# EasyEDA Pro project ProPrj_智能视觉集成板-V1.0.epro, board PCB1
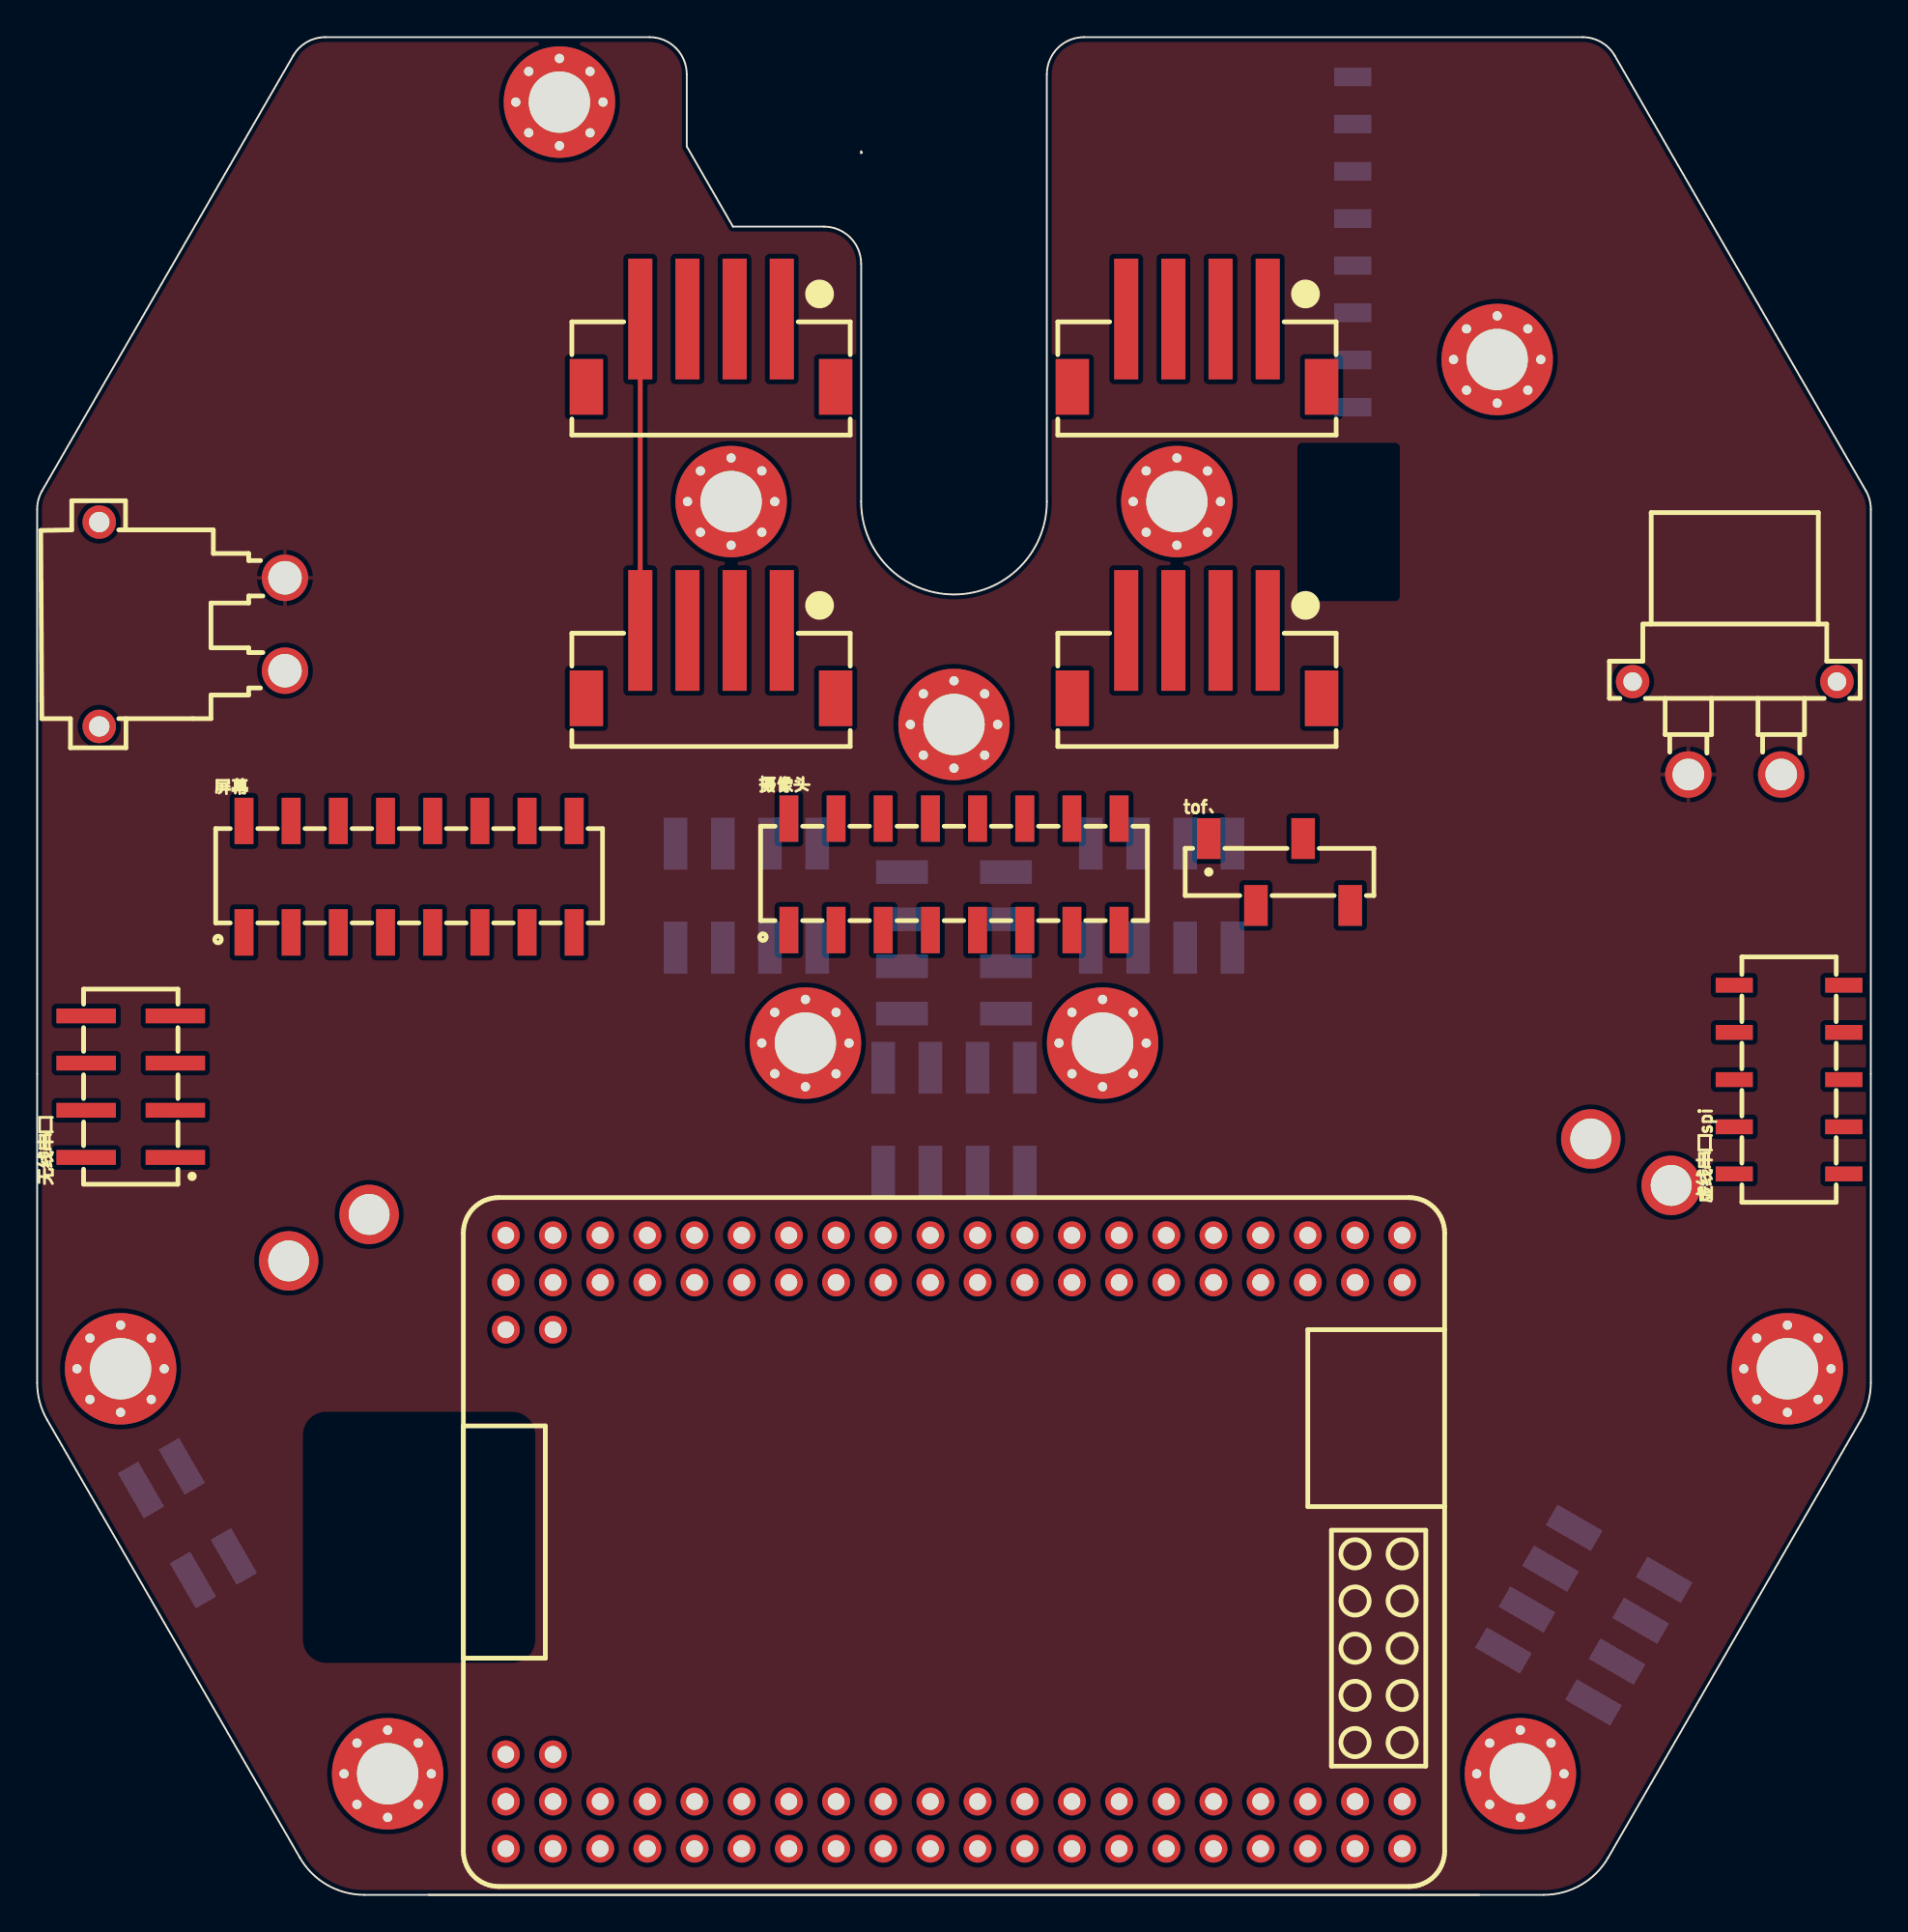
[diagram p8: board, top side]
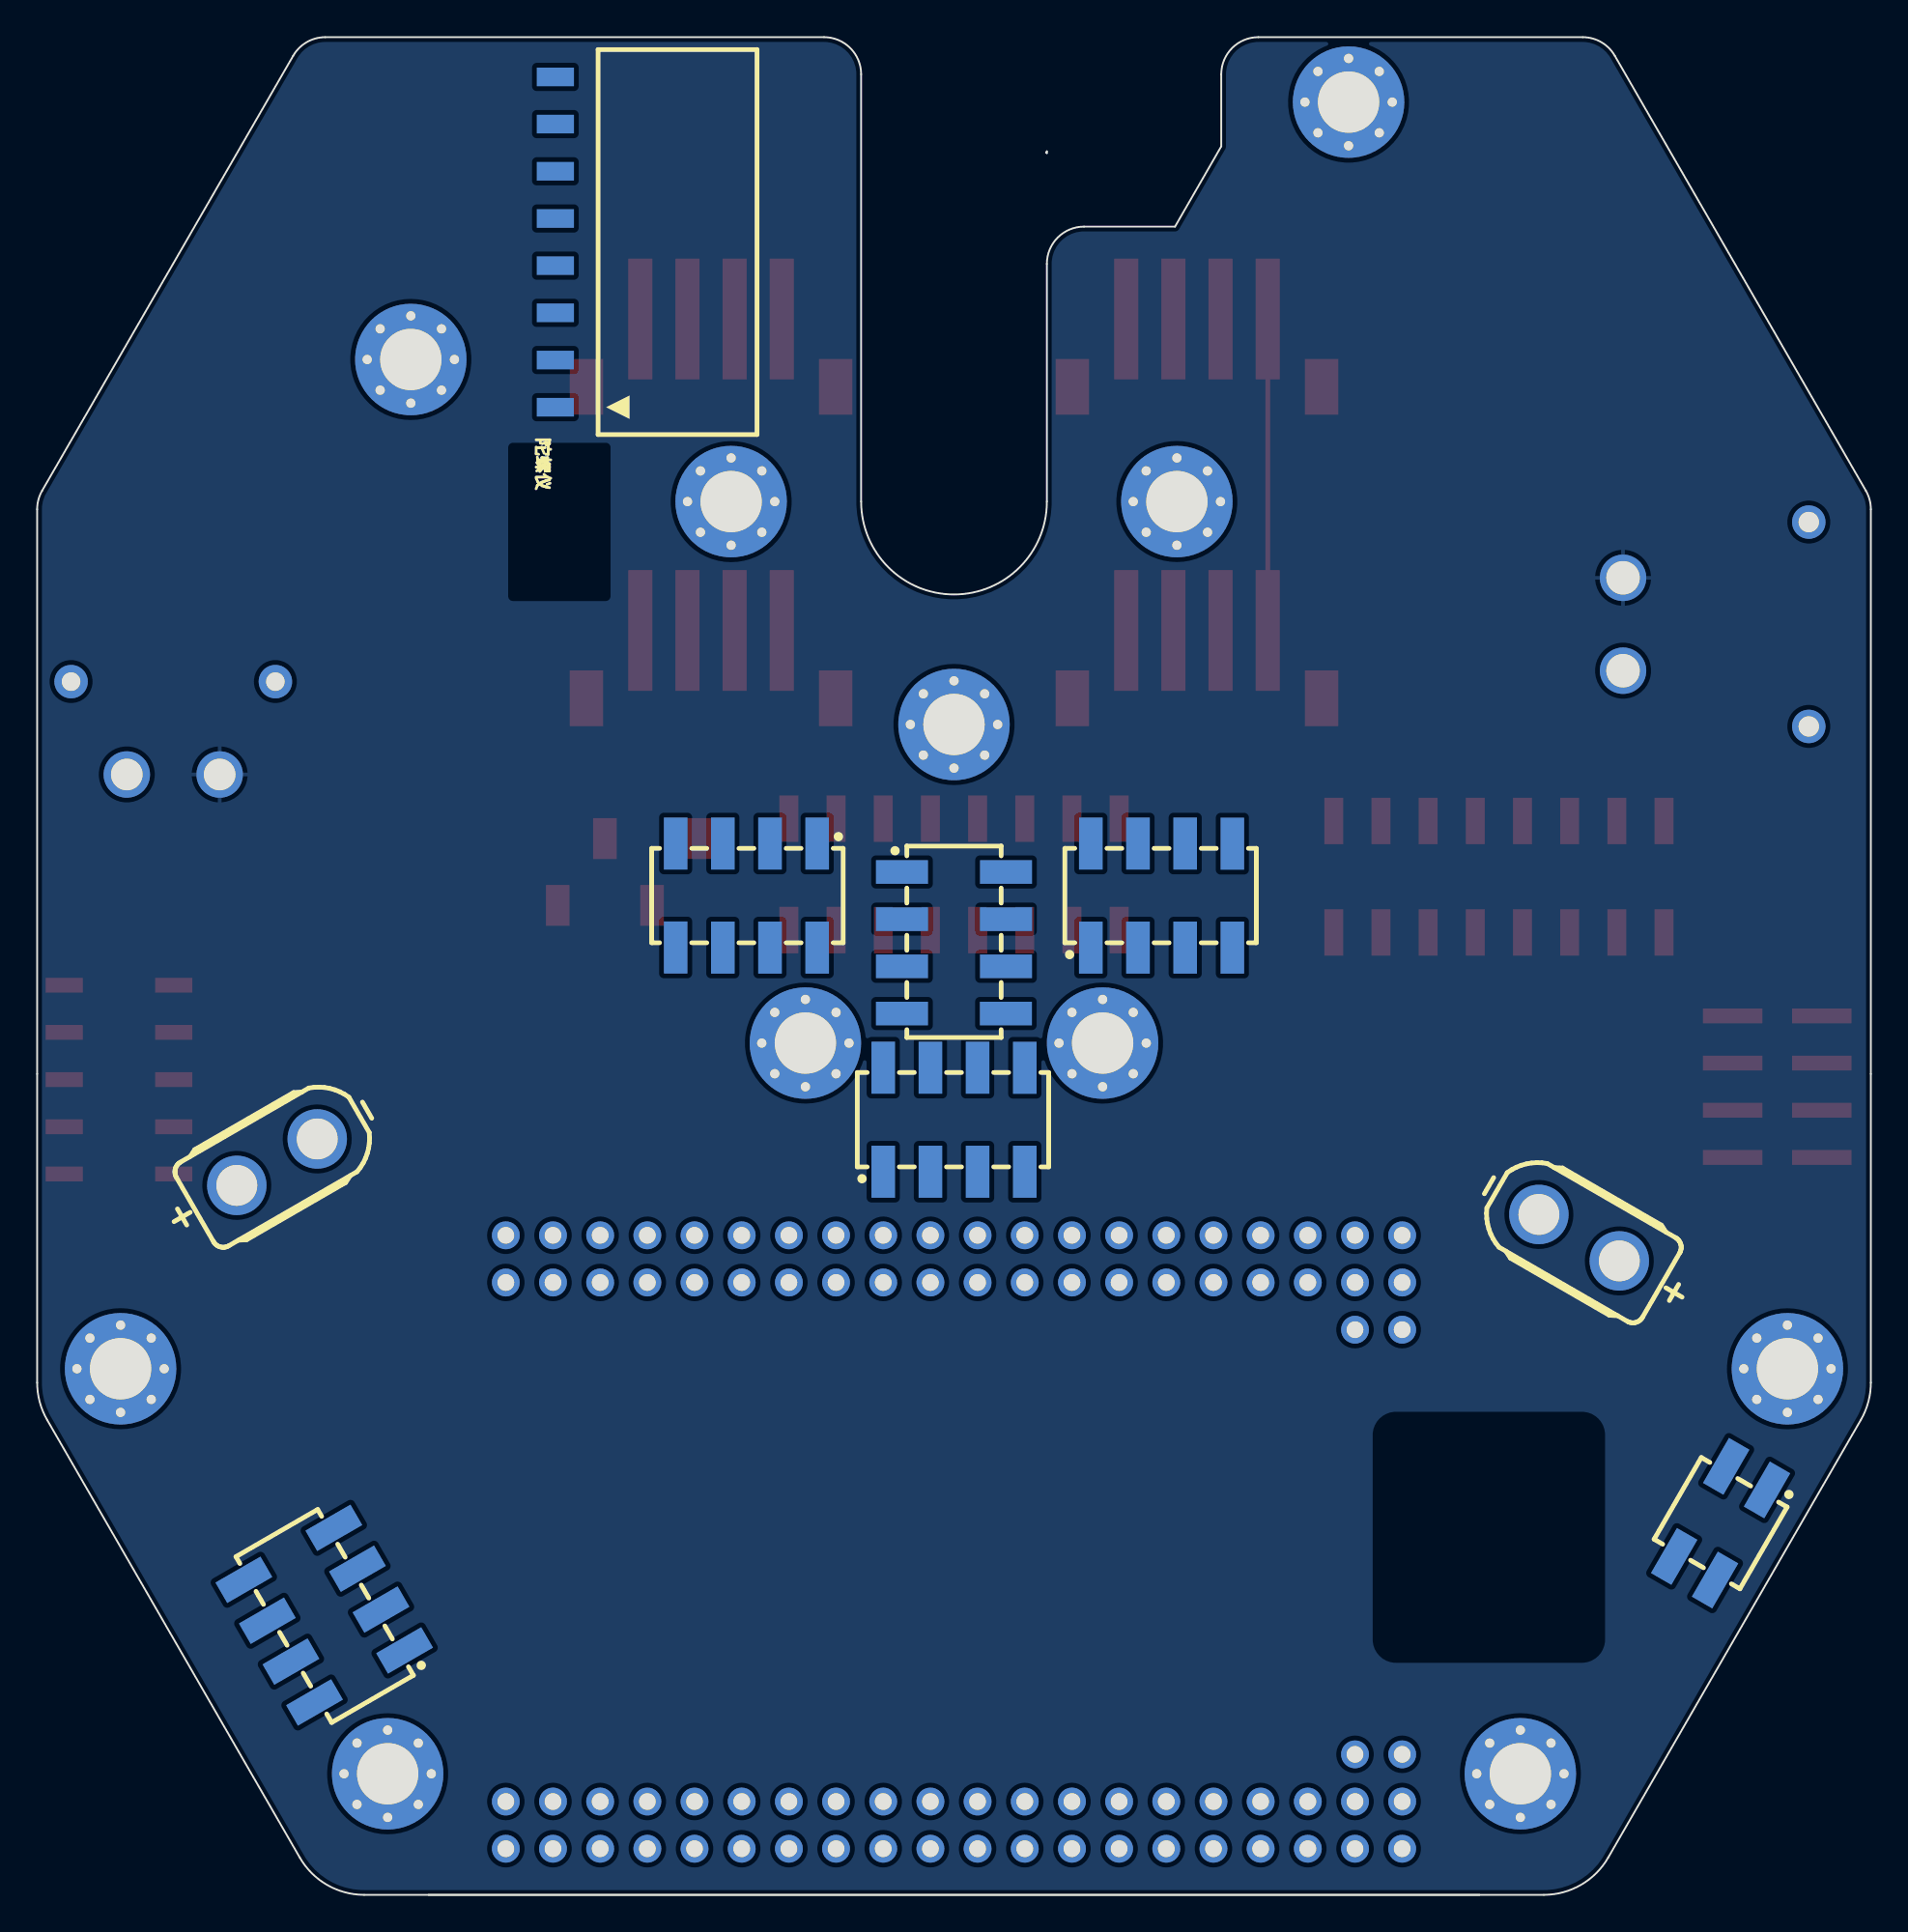
[diagram p9: board, bottom side, seen from below]

Outline 98.73 x 100 mm; copper layers: Top Layer, Bottom Layer. Coordinates in mm from the lower left corner of the outline.
Outline path: 21.07,0 77.65,0 ; 0,74.59 arc(0.07,75.1) 0.27,75.59 13.79,99 arc(14.52,99.73) 15.52,100 32.98,100 arc(34.39,99.41) 34.98,98 34.98,94.12 37.46,89.8 42.36,89.8 arc(43.78,89.21) 44.36,87.8 44.36,75 arc(49.36,70) 54.36,75 54.36,98 arc(54.95,99.41) 56.36,100 83.21,100 arc(84.21,99.73) 84.94,99 98.46,75.59 arc(98.66,75.1) 98.73,74.59 98.73,27.57 arc(98.59,26.54) 98.19,25.57 84.58,2 arc(83.12,0.54) 81.12,0 17.61,0 arc(15.61,0.54) 14.14,2 0.54,25.57 arc(0.14,26.54) 0,27.57 0,74.59 ; 44.36,93.76 44.36,93.85 44.4,93.78 44.36,93.76
Stack: Top Layer 0.035mm / Dielectric1 1.51mm FR4 er 4.5 / Bottom Layer 0.035mm

## Design rules (mm)
template: JLCPCB Capability(Two Layers Board)
spacing copperThickness1oz (default): track to track 0.102, other pairs 0.152 to 0.3
spacing copperThickness2oz: track to track 0.203, other pairs 0.152 to 0.3
track width copperThickness1oz (default): min 0.127, default 0.254, max 2.54
track width copperThickness2oz: min 0.203, default 0.254, max 2.54
differential pair differentialPair (default): width min 0.127, default 0.254, max 2.54; gap min 0.152, default 0.152
via viaSize (default): diameter min 0.5, default 0.61, max 10; hole min 0.3, default 0.305, max 6.3

## Placement (name value [footprint] x y rotation side)
CN6  XT30PW-M30.G.Y  [CONN-TH_XT30PW-M]  8.34 68.4 270 top
CN8  XT30UPB-F30.G.Y  [CONN-TH_XT30UPB-F]  85.81 39.44 150 bottom
CN9  XT30UPB-F30.G.Y  [CONN-TH_XT30UPB-F]  15.71 35.38 30 bottom
H1  2.54-2*4P立贴针  [HDR-SMD_8P-P2.54-V-M-R2-C4-LS7.4]  49.36 41.73 180 bottom
H2  2.54-2*4P立贴针  [HDR-SMD_8P-P2.54-V-M-R2-C4-LS7.4]  49.36 51.25 270 bottom
H3  2.54-2*4P立贴针  [HDR-SMD_8P-P2.54-V-M-R2-C4-LS7.4]  83.27 15.06 60 bottom
H4  2.54-2*4P立贴针  [HDR-SMD_8P-P2.54-V-M-R2-C4-LS7.4]  60.54 53.79 0 bottom
H5  2.54-2*4P立贴针  [HDR-SMD_8P-P2.54-V-M-R2-C4-LS7.4]  38.19 53.79 180 bottom
H6  X6521WVS-2x02H-C60D74  [HDR-SMD_4P-P2.54-V-M-R2-C5-S7.4]  8.09 20.01 30 bottom
J1  -  [M3螺帽]  18.87 6.52 0 top
J2  -  [M3螺帽]  57.36 45.85 0 top
J3  -  [M3螺帽]  41.36 45.85 0 top
J4  -  [M3螺帽]  79.86 6.52 0 top
J5  -  [M3螺帽]  94.24 28.32 0 top
J6  -  [M3螺帽]  4.49 28.32 0 top
J7  -  [M3螺帽]  37.36 75 0 top
J8  -  [M3螺帽]  28.12 96.5 0 top
J9  -  [M3螺帽]  49.36 63 0 top
J10  -  [M3螺帽]  61.36 75 0 top
J11  -  [M3螺帽]  78.61 82.65 0 top
tof、  X6511WVS-04H-C60D48R1  [HDR-SMD_4P-P2.54-V-M-S4.8]  66.89 55.06 0 top
U56  XT30PW-F20.G.Y  [CONN-TH_XT30PW-F-1]  91.4 62.81 180 top
U59  HX 2.54-4PIN LTJS  [CONN-SMD_4P-P2.54_HX-2.54-4PIN-LTJS]  62.44 83 0 top
U60  HX 2.54-4PIN LTJS  [CONN-SMD_4P-P2.54_HX-2.54-4PIN-LTJS]  62.44 66.24 0 top
U61  -  [MIMXRT1064xVL_CoreBoard - 3D]  49.36 18.99 180 top
U62  HX 2.54-4PIN LTJS  [CONN-SMD_4P-P2.54_HX-2.54-4PIN-LTJS]  36.28 83 0 top
U63  HX 2.54-4PIN LTJS  [CONN-SMD_4P-P2.54_HX-2.54-4PIN-LTJS]  36.28 66.24 0 top
屏幕  PM254-2-08-S-8.5  [HDR-SMD_16P-P2.54-V-F-R2-C8-LS7.1]  20.03 54.81 0 top
摄像头  PM254-2-08-S-8.5  [HDR-SMD_16P-P2.54-V-F-R2-C8-LS7.1]  49.36 54.93 0 top
无线串口  PM254-2-04-S-8.5  [HDR-SMD_8P-P2.54-V-F-R2-C4-S7.1]  5.04 43.5 90 top
虚线串口spi  PM254-2-05-S-8.5  [HDR-SMD_10P-P2.54-V-F-R2-C5-LS7.1-1]  94.32 43.89 90 top
陀螺仪  X6511FRS-08-C85D30  [HDR-SMD_8P-P2.54-H-F-L11.5]  70.83 88.97 90 bottom

## Footprints (pads in the part's own frame, mm; a bottom-side part is the same pattern mirrored in y, then rotated)
CONN-SMD_4P-P2.54_HX-2.54-4PIN-LTJS
  rect 1.3x6.5 smd: 1(3.81,1.825) 2(1.27,1.825) 3(-1.27,1.825) 4(-3.81,1.825)
  rect 1.8x3 smd: 5(-6.71,-1.825) 6(6.71,-1.825)
CONN-TH_XT30PW-F-1
  round 2.5 hole 1.7: 1(-2.5,2.5) 2(2.5,2.5)
  round 1.8 hole 1: 3(5.5,-2.5) 4(-5.5,-2.5)
CONN-TH_XT30PW-M
  round 2.5 hole 1.8: 1(-2.5,5) 2(2.5,5)
  round 1.8 hole 1.1: 3(5.5,-5) 4(-5.5,-5)
CONN-TH_XT30UPB-F
  round 3.2 hole 2.2: 1(-2.5,0) 2(2.5,0)
HDR-SMD_4P-P2.54-V-M-R2-C5-S7.4
  rect 1.27x2.8 smd: 1(-1.27,-2.8) 2(-1.27,2.8) 3(1.27,-2.8) 4(1.27,2.8)
HDR-SMD_4P-P2.54-V-M-S4.8
  rect 1.27x2.2 smd: 1(-3.81,1.8) 2(-1.27,-1.8) 3(1.27,1.8) 4(3.81,-1.8)
HDR-SMD_8P-P2.54-H-F-L11.5
  rect 1x2 smd: 1(-8.89,0) 2(-6.35,0) 3(-3.81,0) 4(-1.27,0) 5(1.27,0) 6(3.81,0) 7(6.35,0) 8(8.89,0)
HDR-SMD_8P-P2.54-V-F-R2-C4-S7.1
  rect 0.8x3.2 smd: 1(-3.81,-2.4) 2(-3.81,2.4) 3(-1.27,-2.4) 4(-1.27,2.4) 5(1.27,-2.4) 6(1.27,2.4) 7(3.81,-2.4) 8(3.81,2.4)
HDR-SMD_8P-P2.54-V-M-R2-C4-LS7.4
  rect 1.27x2.8 smd: 1(-3.81,-2.8) 2(-3.81,2.8) 3(-1.27,-2.8) 4(-1.27,2.8) 5(1.27,-2.8) 6(1.27,2.8) 7(3.81,-2.8) 8(3.81,2.794)
HDR-SMD_10P-P2.54-V-F-R2-C5-LS7.1-1
  rect 0.8x2 smd: 1(-5.08,-2.95) 2(-2.54,-2.95) 3(0,-2.95) 4(2.54,-2.95) 5(5.08,-2.95) 6(5.08,2.95) 7(2.54,2.95) 8(0,2.95) 9(-2.54,2.95) 10(-5.08,2.95)
HDR-SMD_16P-P2.54-V-F-R2-C8-LS7.1
  rect 1.02x2.5 smd: 1(-8.89,-3) 2(-8.89,3) 3(-6.35,-3) 4(-6.35,3) 5(-3.81,-3) 6(-3.81,3) 7(-1.27,-3) 8(-1.27,3) 9(1.27,-3) 10(1.27,3) 11(3.81,-3) 12(3.81,3) 13(6.35,-3) 14(6.35,3) 15(8.89,-3) 16(8.89,3)
M3螺帽
  round 6 hole 3.302: 1(0,0)
  round 1 hole 0.5: 2(0,2.349) 3(0,-2.349) 4(2.349,0) 5(-2.349,0) 6(1.651,1.651) 7(-1.651,-1.651) 8(1.651,-1.651) 9(-1.651,1.651)
MIMXRT1064xVL_CoreBoard - 3D
  round 1.5 hole 0.9: 1(-24.13,-16.51) 2(-24.13,-13.97) 3(-21.59,-16.51) 4(-21.59,-13.97) 5(-19.05,-16.51) 6(-19.05,-13.97) 7(-16.51,-16.51) 8(-16.51,-13.97) 9(-13.97,-16.51) 10(-13.97,-13.97) 11(-11.43,-16.51) 12(-11.43,-13.97) 13(-8.89,-16.51) 14(-8.89,-13.97) 15(-6.35,-16.51) 16(-6.35,-13.97) 17(-3.81,-16.51) 18(-3.81,-13.97) 19(-1.27,-16.51) 20(-1.27,-13.97) 21(1.27,-16.51) 22(1.27,-13.97) 23(3.81,-16.51) 24(3.81,-13.97) 25(6.35,-16.51) 26(6.35,-13.97) 27(8.89,-16.51) 28(8.89,-13.97) 29(11.43,-16.51) 30(11.43,-13.97) 31(13.97,-16.51) 32(13.97,-13.97) 33(16.51,-16.51) 34(16.51,-13.97) 35(19.05,-16.51) 36(19.05,-13.97) 37(21.59,-16.51) 38(21.59,-13.97) 39(24.13,-16.51) 40(24.13,-13.97) 41(21.59,-11.43) 42(24.13,-11.43) 43(24.13,11.43) 44(21.59,11.43) 45(24.13,13.97) 46(24.13,16.51) 47(21.59,13.97) 48(21.59,16.51) 49(19.05,13.97) 50(19.05,16.51) 51(16.51,13.97) 52(16.51,16.51) 53(13.97,13.97) 54(13.97,16.51) 55(11.43,13.97) 56(11.43,16.51) 57(8.89,13.97) 58(8.89,16.51) 59(6.35,13.97) 60(6.35,16.51) 61(3.81,13.97) 62(3.81,16.51) 63(1.27,13.97) 64(1.27,16.51) 65(-1.27,13.97) 66(-1.27,16.51) 67(-3.81,13.97) 68(-3.81,16.51) 69(-6.35,13.97) 70(-6.35,16.51) 71(-8.89,13.97) 72(-8.89,16.51) 73(-11.43,13.97) 74(-11.43,16.51) 75(-13.97,13.97) 76(-13.97,16.51) 77(-16.51,13.97) 78(-16.51,16.51) 79(-19.05,13.97) 80(-19.05,16.51) 81(-21.59,13.97) 82(-21.59,16.51) 83(-24.13,13.97) 84(-24.13,16.51)

## Nets
As in the schematic.

Pads without a net: CN6 3 4; CN8 1 2; CN9 1 2; H1 1 2 3 4 5 6 7 8; H2 1 2 3 4 5 6 7 8; H3 1 2 3 4 5 6 7 8; H4 1 2 3 4 5 6 7 8; H5 1 2 3 4 5 6 7 8; H6 1 2 3 4; J1 2 3 4 5 6 7 8 9; J2 2 3 4 5 6 7 8 9; J3 2 3 4 5 6 7 8 9; J4 2 3 4 5 6 7 8 9; J5 2 3 4 5 6 7 8 9; J6 2 3 4 5 6 7 8 9; J7 2 3 4 5 6 7 8 9; J8 2 3 4 5 6 7 8 9; J9 2 3 4 5 6 7 8 9; J10 2 3 4 5 6 7 8 9; J11 2 3 4 5 6 7 8 9; tof、 1 2 3 4; U56 3 4; U59 1 2 3 4 5 6; U60 1 2 3 4 5 6; U61 1 2 3 4 5 6 7 8 9 10 11 12 13 14 15 16 17 18 19 20 21 22 23 24 25 26 27 28 29 30 31 32 33 34 35 36 37 38 39 40 41 42 43 44 45 46 47 48 49 50 51 52 53 54 55 56 57 58 59 60 61 62 63 64 65 66 67 68 69 70 71 72 73 74 75 76 77 78 79 80 81 82 83 84; U62 1 2 3 4 5 6; U63 1 2 3 4 5 6; 屏幕 1 2 3 4 5 6 7 8 9 10 11 12 13 14 15 16; 摄像头 1 2 3 4 5 6 7 8 9 10 11 12 13 14 15 16; 无线串口 1 2 3 4 5 6 7 8; 虚线串口spi 1 2 3 4 5 6 7 8 9 10; 陀螺仪 1 2 3 4 5 6 7 8

## Routing (per net, layer and track width the routed paths; a pad name or vN(x,y) marks a point on that pad's centre or on a via; arc(x,y) is an arc through that point)
(no net): length 16.8
  Top Layer w0.254: U62.4 U63.4

## Copper pours and planes (outline as drawn; the poured copper is in the pictures)
BATGND on Top Layer: -18.71,110.69 113.75,110.69 113.75,-14.41 -18.71,-14.41
BATGND on Bottom Layer: -13.37,107.26 106.77,107.26 106.77,-10.09 -13.37,-10.09
